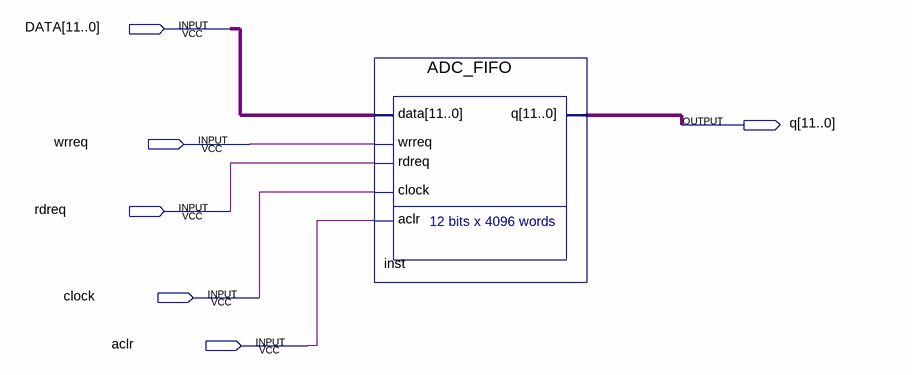
[diagram p0: schematic sheet]
// Quartus schematic TP_Final_DSP_FPGA.bdf as structural Verilog: 1 symbols, 6 pins
module TP_Final_DSP_FPGA (
  input  [11:0] DATA,
  input  wrreq,
  input  rdreq,
  input  clock,
  input  aclr,
  output [11:0] q
);

  ADC_FIFO inst (.data(DATA), .wrreq(wrreq), .rdreq(rdreq), .clock(clock), .aclr(aclr), .q(q));
endmodule
